# Altium project QUTMS-BrakeLight.PrjPcb
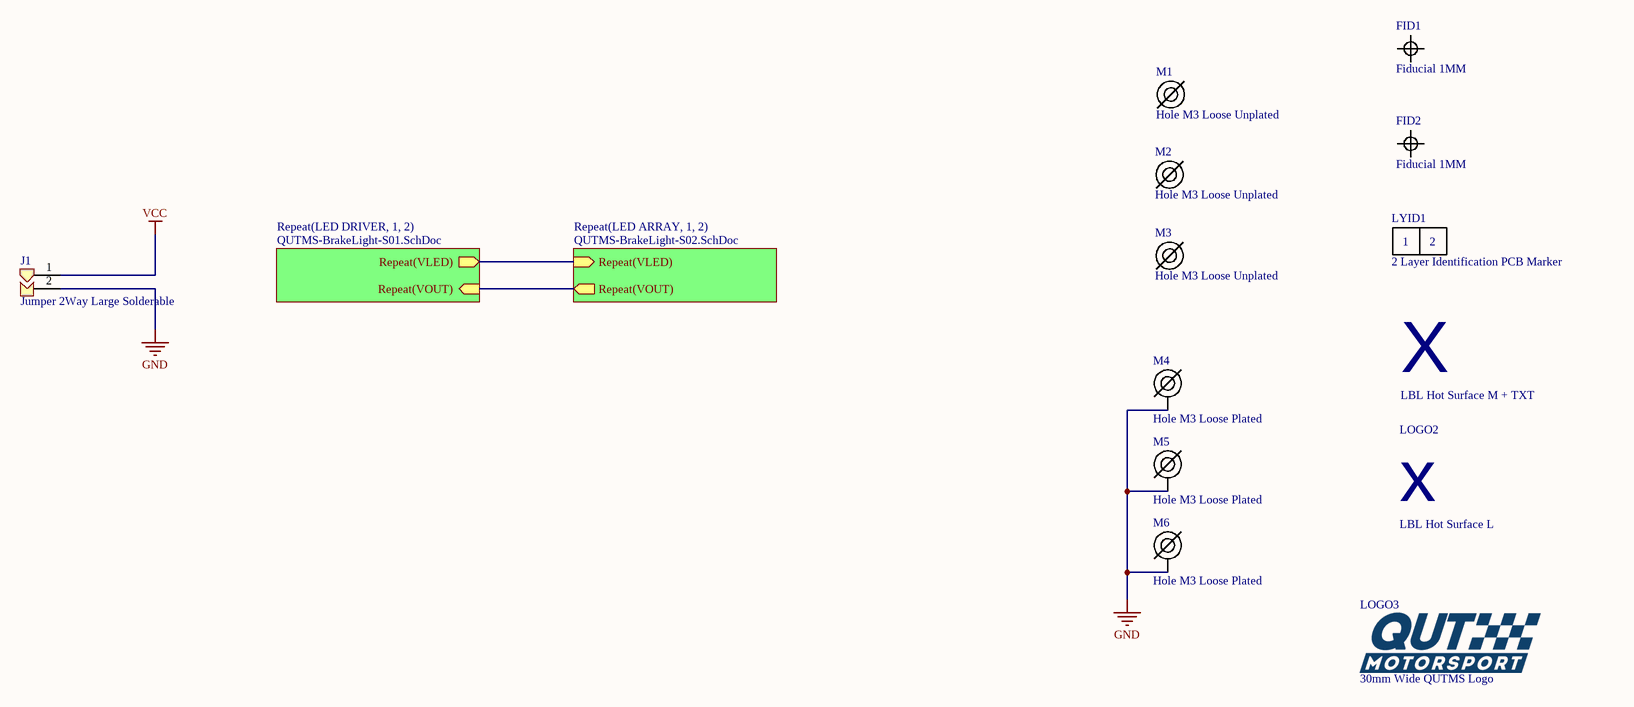
[diagram p0: QUTMS-BrakeLight-S00.SchDoc]
3 sheets, 33 parts. Net scope: hierarchical (ports join the sheet entries above them; power ports are global).
Board file: QUTMS-BrakeLight-B00.PcbDoc
Sheets:
  QUTMS-BrakeLight-S00.SchDoc
    LED DRIVER1 = QUTMS-BrakeLight-S01.SchDoc
    LED DRIVER2 = QUTMS-BrakeLight-S01.SchDoc
    LED ARRAY1 = QUTMS-BrakeLight-S02.SchDoc
    LED ARRAY2 = QUTMS-BrakeLight-S02.SchDoc

## Sheet QUTMS-BrakeLight-S00.SchDoc: Brake Light
size A3; Author: Joseph Richards; DrawnBy: Joseph Richards; Engineer: Joseph Richards; Organization: QUTMS; DocumentNumber: 1; Revision: 2; SheetNumber: 1; SheetTotal: 3

### Parts
FID1  Fiducial 1MM  [FIDUCIAL 1MM]
FID2  Fiducial 1MM  [FIDUCIAL 1MM]
J1  Jumper 2Way Large Solderable  [Jumper_2Way_Large_Solder_Pad]
LOGO1  LBL Hot Surface M + TXT  [LBL HOT MEDIUM TXT]
LOGO2  LBL Hot Surface L  [LBL HOT LARGE]
LOGO3  30mm Wide QUTMS Logo  [QUTMS LOGO 30MM]
LYID1  2 Layer Identification PCB Marker  [LAYER IDENT 2]
M1  Hole M3 Loose Unplated  [M3.5 UNPLATED]
M2  Hole M3 Loose Unplated  [M3.5 UNPLATED]
M3  Hole M3 Loose Unplated  [M3.5 UNPLATED]
M4  Hole M3 Loose Plated  [M3.5 PLATED]
M5  Hole M3 Loose Plated  [M3.5 PLATED]
M6  Hole M3 Loose Plated  [M3.5 PLATED]

### Sub-sheets
Repeat(LED ARRAY, 1, 2) = QUTMS-BrakeLight-S02.SchDoc: Repeat(VOUT) (out), Repeat(VLED) (in)
Repeat(LED DRIVER, 1, 2) = QUTMS-BrakeLight-S01.SchDoc: Repeat(VLED) (out), Repeat(VOUT) (in)

### Nets
GND: J1.2 M4.1 M5.1 M6.1
VCC: J1.1
(unnamed): sheet Repeat(LED DRIVER, 1, 2)/Repeat(VLED), sheet Repeat(LED ARRAY, 1, 2)/Repeat(VLED)
(unnamed): sheet Repeat(LED DRIVER, 1, 2)/Repeat(VOUT), sheet Repeat(LED ARRAY, 1, 2)/Repeat(VOUT)

### Notes on the sheet
- Revision History:
- Sheet Title:
- Rev
- Date
- Description
- Project:
- Size:
- Drawn By:
- A3
- Number:
- Revision:
- Sheet
- Version:
- of
- QUT Motorsport
- O-120, Gardens Point
- 2 George Street
- Brisbane, QLD 4000
- Australia
- Print Date:
- Print Time:
- File Name:
- (in symbol Layer Identification 2) 1; 2
- (in symbol LBL Hot Surface L) x
- (in symbol LBL Hot Surface M + TXT) X

### Library data of the parts
J1 = Jumper 2Way Side Large Solder Pad: Jumper 2Way Large Side Solderable Pad
LOGO3 = QUTMS Logo 30mm
LYID1 = Layer Identification 2
M1-M3 = Hole M3 Loose Unplated: M3.5 Hole, No Plating
M4-M6 = Hole M3 Loose Plated: M3.5 Hole, Plated

## Sheet QUTMS-BrakeLight-S01.SchDoc: LED Driver
size A3; Author: Joseph Richards; DrawnBy: Joseph Richards; Engineer: Joseph Richards; Organization: QUTMS; DocumentNumber: 2; Revision: 1; SheetNumber: 2; SheetTotal: 3
Used 2 times, as channels LED DRIVER1, LED DRIVER2. Parts and nets are listed once, with the designators drawn on the sheet.
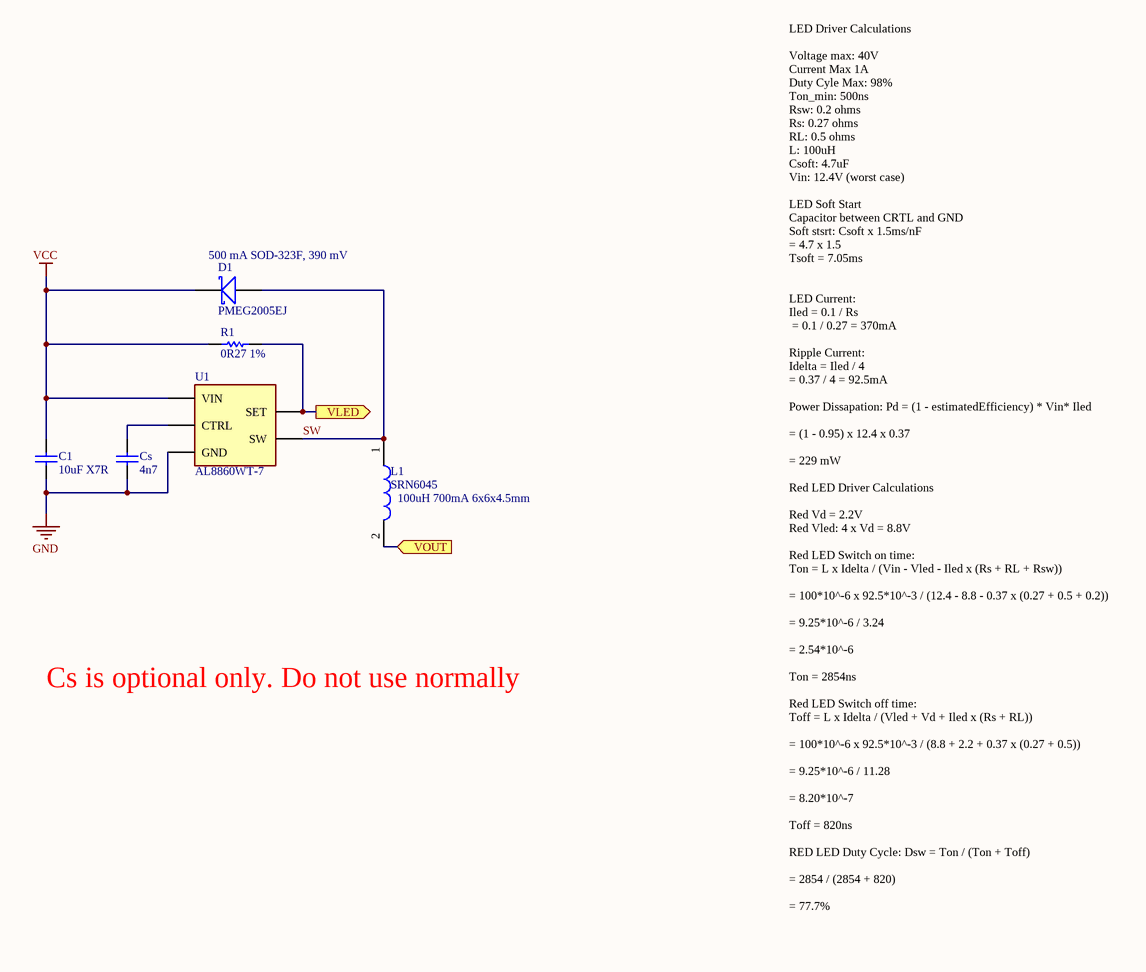
[diagram p1: QUTMS-BrakeLight-S01.SchDoc]

### Parts
C1  10uF X7R  [Cap_Ceramic_0603]
Cs  4n7  [Cap_Ceramic_0603]
D1  PMEG2005EJ  [SOD-323F]
L1  SRN6045  [Bourns Inductor 6x6x4.5mm]
R1  0R27 1%  [Res_ThinFilm_0603]
U1  AL8860WT-7  [TSOT-25]

### Ports
VLED (out), VOUT (in)

### Nets
GND: C1.1 Cs.1 U1.2(GND)
VCC: C1.2 D1.K(Cathode) R1.1 U1.5(VIN)
SW: D1.A(Anode) L1.1 U1.1(SW)
VLED: R1.2 U1.4(SET) ; port VLED
VOUT: L1.2 ; port VOUT
NetCs_2: Cs.2 U1.3(CTRL)

### Channels
LED DRIVER1: designators end in A; ports VLED=NetR1A_2 VOUT=NetL1A_2
LED DRIVER2: designators end in B; ports VLED=NetR1B_2 VOUT=NetL1B_2

### Notes on the sheet
- (near D1) 500 mA SOD-323F, 390 mV
- (near L1) 100uH 700mA 6x6x4.5mm
- Cs is optional only. Do not use normally
- LED Driver Calculations
  Voltage max: 40V
  Current Max 1A
  Duty Cyle Max: 98%
  Ton_min: 500ns
  Rsw: 0.2 ohms
  Rs: 0.27 ohms
  RL: 0.5 ohms
  L: 100uH
  Csoft: 4.7uF
  Vin: 12.4V (worst case)
  LED Soft Start
  Capacitor between CRTL and GND
  Soft stsrt: Csoft x 1.5ms/nF
  = 4.7 x 1.5
  Tsoft = 7.05ms
  LED Current:
  Iled = 0.1 / Rs
  = 0.1 / 0.27 = 370mA
  Ripple Current:
  Idelta = Iled / 4
  = 0.37 / 4 = 92.5mA
  Power Dissapation: Pd = (1 - estimatedEfficiency) * Vin* Iled
  = (1 - 0.95) x 12.4 x 0.37
  = 229 mW
  Red LED Driver Calculations
  Red Vd = 2.2V
  Red Vled: 4 x Vd = 8.8V
  Red LED Switch on time:
  Ton = L x Idelta / (Vin - Vled - Iled x (Rs + RL + Rsw))
  = 100*10^-6 x 92.5*10^-3 / (12.4 - 8.8 - 0.37 x (0.27 + 0.5 + 0.2))
  = 9.25*10^-6 / 3.24
  = 2.54*10^-6
  Ton = 2854ns
  Red LED Switch off time:
  Toff = L x Idelta / (Vled + Vd + Iled x (Rs + RL))
  = 100*10^-6 x 92.5*10^-3 / (8.8 + 2.2 + 0.37 x (0.27 + 0.5))
  = 9.25*10^-6 / 11.28
  = 8.20*10^-7
  Toff = 820ns
  RED LED Duty Cycle: Dsw = Ton / (Ton + Toff)
  = 2854 / (2854 + 820)
  = 77.7%
- Revision History:
- Sheet Title:
- Rev
- Date
- Description
- Project:
- Size:
- Drawn By:
- A3
- Number:
- Revision:
- Sheet
- Version:
- of
- QUT Motorsport
- O-120, Gardens Point
- 2 George Street
- Brisbane, QLD 4000
- Australia
- Print Date:
- Print Time:
- File Name:

### Library data of the parts
C1 = 10uF 50V 5% X7R 0603: Capacitor, Ceramic, SMD, 10uF, 50V, 5%, X7R, 0603
Cs = 4n7 25V 5% X7R 0603: Capacitor, Ceramic, SMD, 4n7, 25V, 5%, X7R, 0603
D1 = PMEG2005EJ: PMEG2005EJ,115 -  Schottky Rectifier, 20 V, 500 mA, Single, SOD-323F, 2 Pins, 390 mV; ComponentLink1Description: Element14; ComponentLink1URL: https://au.element14.com/nexperia/pmeg2005ej-115/schottky-rect-20v-0-5a-sod323f/dp/1757760
L1 = SRN6045: Power Inductor (SMD), 100 µH, 700 mA, Semishielded, 800 mA; ComponentLink1Description: Element14; ComponentLink1URL: https://au.element14.com/bourns/srn6045-101m/inductor-100uh-semi-shielded-power/dp/2061658
R1 = 0R27 1% 0603: ERJ3RQFR27V - SMD Current Sense Resistor, 0273 ohm, ERJ3R Series, 0603 [1608 Metric], 100 mW, ± 1%, Thick Film; ComponentLink1Description: Element14; ComponentLink1URL: https://au.element14.com/tt-electronics-welwyn/lcs0603-r30ft5/current-sense-res-0r3-1-100-mw/dp/2663681
U1 = AL8860WT-7: AL8860WT-7 -  LED Driver, 1 Output, Buck (Step Down), 4.5 V to 40 V in, 1 MHz switch, PWM, 40V/1 A out, TSOT-25-5

## Sheet QUTMS-BrakeLight-S02.SchDoc: Red LED Array
size A3; DrawnBy: Joseph Richards; DocumentNumber: 3; Revision: 1; SheetNumber: 3; SheetTotal: 3
Used 2 times, as channels LED ARRAY1, LED ARRAY2. Parts and nets are listed once, with the designators drawn on the sheet.
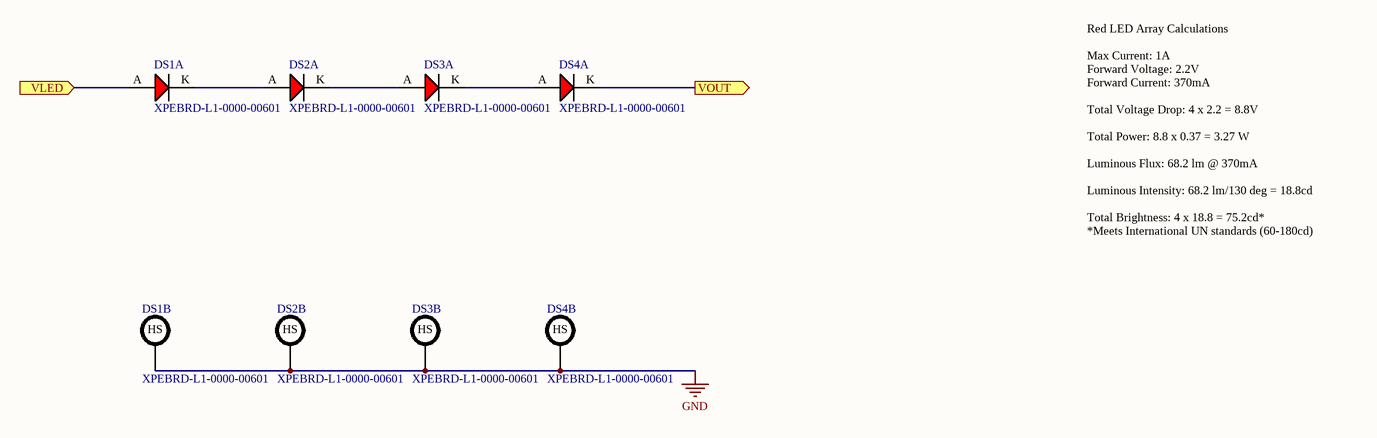
[diagram p2: QUTMS-BrakeLight-S02.SchDoc]

### Parts
DS1  XPEBRD-L1-0000-00601  [Cree XLamp XP-E2]  (parts A,B of 2)
DS2  XPEBRD-L1-0000-00601  [Cree XLamp XP-E2]  (parts A,B of 2)
DS3  XPEBRD-L1-0000-00601  [Cree XLamp XP-E2]  (parts A,B of 2)
DS4  XPEBRD-L1-0000-00601  [Cree XLamp XP-E2]  (parts A,B of 2)

### Ports
VLED (in), VOUT (out)

### Nets
GND: DS1.HS DS2.HS DS3.HS DS4.HS
VLED: DS1.A ; port VLED
VOUT: DS4.K ; port VOUT
NetDS1_K: DS1.K DS2.A
NetDS2_K: DS2.K DS3.A
NetDS3_K: DS3.K DS4.A

### Channels
LED ARRAY1: designators end in A; ports VLED=NetDS1A_A VOUT=NetDS4A_K
LED ARRAY2: designators end in B; ports VLED=NetDS1B_A VOUT=NetDS4B_K

### Notes on the sheet
- Red LED Array Calculations
  Max Current: 1A
  Forward Voltage: 2.2V
  Forward Current: 370mA
  Total Voltage Drop: 4 x 2.2 = 8.8V
  Total Power: 8.8 x 0.37 = 3.27 W
  Luminous Flux: 68.2 lm @ 370mA
  Luminous Intensity: 68.2 lm/130 deg = 18.8cd
  Total Brightness: 4 x 18.8 = 75.2cd*
  *Meets International UN standards (60-180cd)
- Revision History:
- Sheet Title:
- Rev
- Date
- Description
- Project:
- Size:
- Drawn By:
- A3
- Number:
- Revision:
- Sheet
- Version:
- of
- QUT Motorsport
- O-120, Gardens Point
- 2 George Street
- Brisbane, QLD 4000
- Australia
- Print Date:
- Print Time:
- File Name:

### Library data of the parts
DS1-DS4 = XPEBRD-L1-0000-00601: LED, Cree XLamp XP-E2 Series, Red, 630 nm, 130 °, 62 lm, 1 A; ComponentLink1Description: Element14; ComponentLink1URL: https://au.element14.com/cree/xpebrd-l1-0000-00601/led-smd-xlamp-xpe-e-red-62lm/dp/2335107

## Nets that join several sheets
GND: QUTMS-BrakeLight-S00 (J1.2 M4.1 M5.1 M6.1), LED DRIVER1 (C1A.1 CsA.1 U1A.2), LED DRIVER2 (C1B.1 CsB.1 U1B.2), LED ARRAY1 (DS1A.HS DS2A.HS DS3A.HS DS4A.HS), LED ARRAY2 (DS1B.HS DS2B.HS DS3B.HS DS4B.HS)
VCC: QUTMS-BrakeLight-S00 (J1.1), LED DRIVER1 (C1A.2 D1A.K R1A.1 U1A.5), LED DRIVER2 (C1B.2 D1B.K R1B.1 U1B.5)